# Altium schematic sheet 5-PWR_ADC3.SCHDOC
size A4
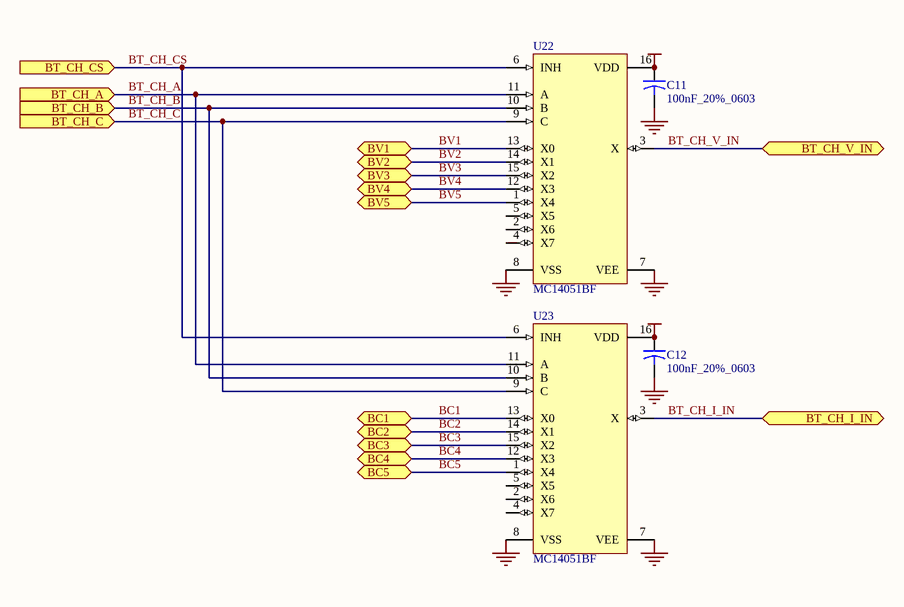
[diagram p0: 5-PWR_ADC3.SCHDOC]

## Parts
C11  100nF_20%_0603  [C1608-0603]
C12  100nF_20%_0603  [C1608-0603]
U22  MC14051BF  [966-01]
U23  MC14051BF  [966-01]

## Ports
BC1 (bidir), BC2 (bidir), BC3 (bidir), BC4 (bidir), BC5 (bidir), BT_CH_A (in), BT_CH_B (in), BT_CH_C (in), BT_CH_CS (in), BT_CH_I_IN (bidir), BT_CH_V_IN (bidir), BV1 (bidir), BV2 (bidir), BV3 (bidir), BV4 (bidir), BV5 (bidir)

## Nets
GND: C11.2 C12.2 U22.7(VEE) U22.8(VSS) U23.7(VEE) U23.8(VSS)
VCC_3V3: C11.1 C12.1 U22.16(VDD) U23.16(VDD)
BC1: U23.13(X0) ; port BC1
BC2: U23.14(X1) ; port BC2
BC3: U23.15(X2) ; port BC3
BC4: U23.12(X3) ; port BC4
BC5: U23.1(X4) ; port BC5
BT_CH_A: U22.11(A) U23.11(A) ; port BT_CH_A
BT_CH_B: U22.10(B) U23.10(B) ; port BT_CH_B
BT_CH_C: U22.9(C) U23.9(C) ; port BT_CH_C
BT_CH_CS: U22.6(INH) U23.6(INH) ; port BT_CH_CS
BT_CH_I_IN: U23.3(X) ; port BT_CH_I_IN
BT_CH_V_IN: U22.3(X) ; port BT_CH_V_IN
BV1: U22.13(X0) ; port BV1
BV2: U22.14(X1) ; port BV2
BV3: U22.15(X2) ; port BV3
BV4: U22.12(X3) ; port BV4
BV5: U22.1(X4) ; port BV5

Not connected (* = marked no-connect by the designer): U22 2(X6) 4(X7) 5(X5); U23 2(X6) 4(X7) 5(X5)

## Library data of the parts
C11 C12 = Cap2: Capacitor; Value: 0.1uF; Published: 23-Sep-2002; Publisher: Altium Limited
U22 U23 = MC14051BF: 8-Channel Analog Multiplexer/Demultiplexer; Published: 17-Jul-2002; DatasheetDocument: Mar-2000; PackageDocument: Mar-2000; PackageReference: 966-01; Publisher: Altium Limited